# EAGLE design RCShield-arm-v0 (EAGLE 6.3)
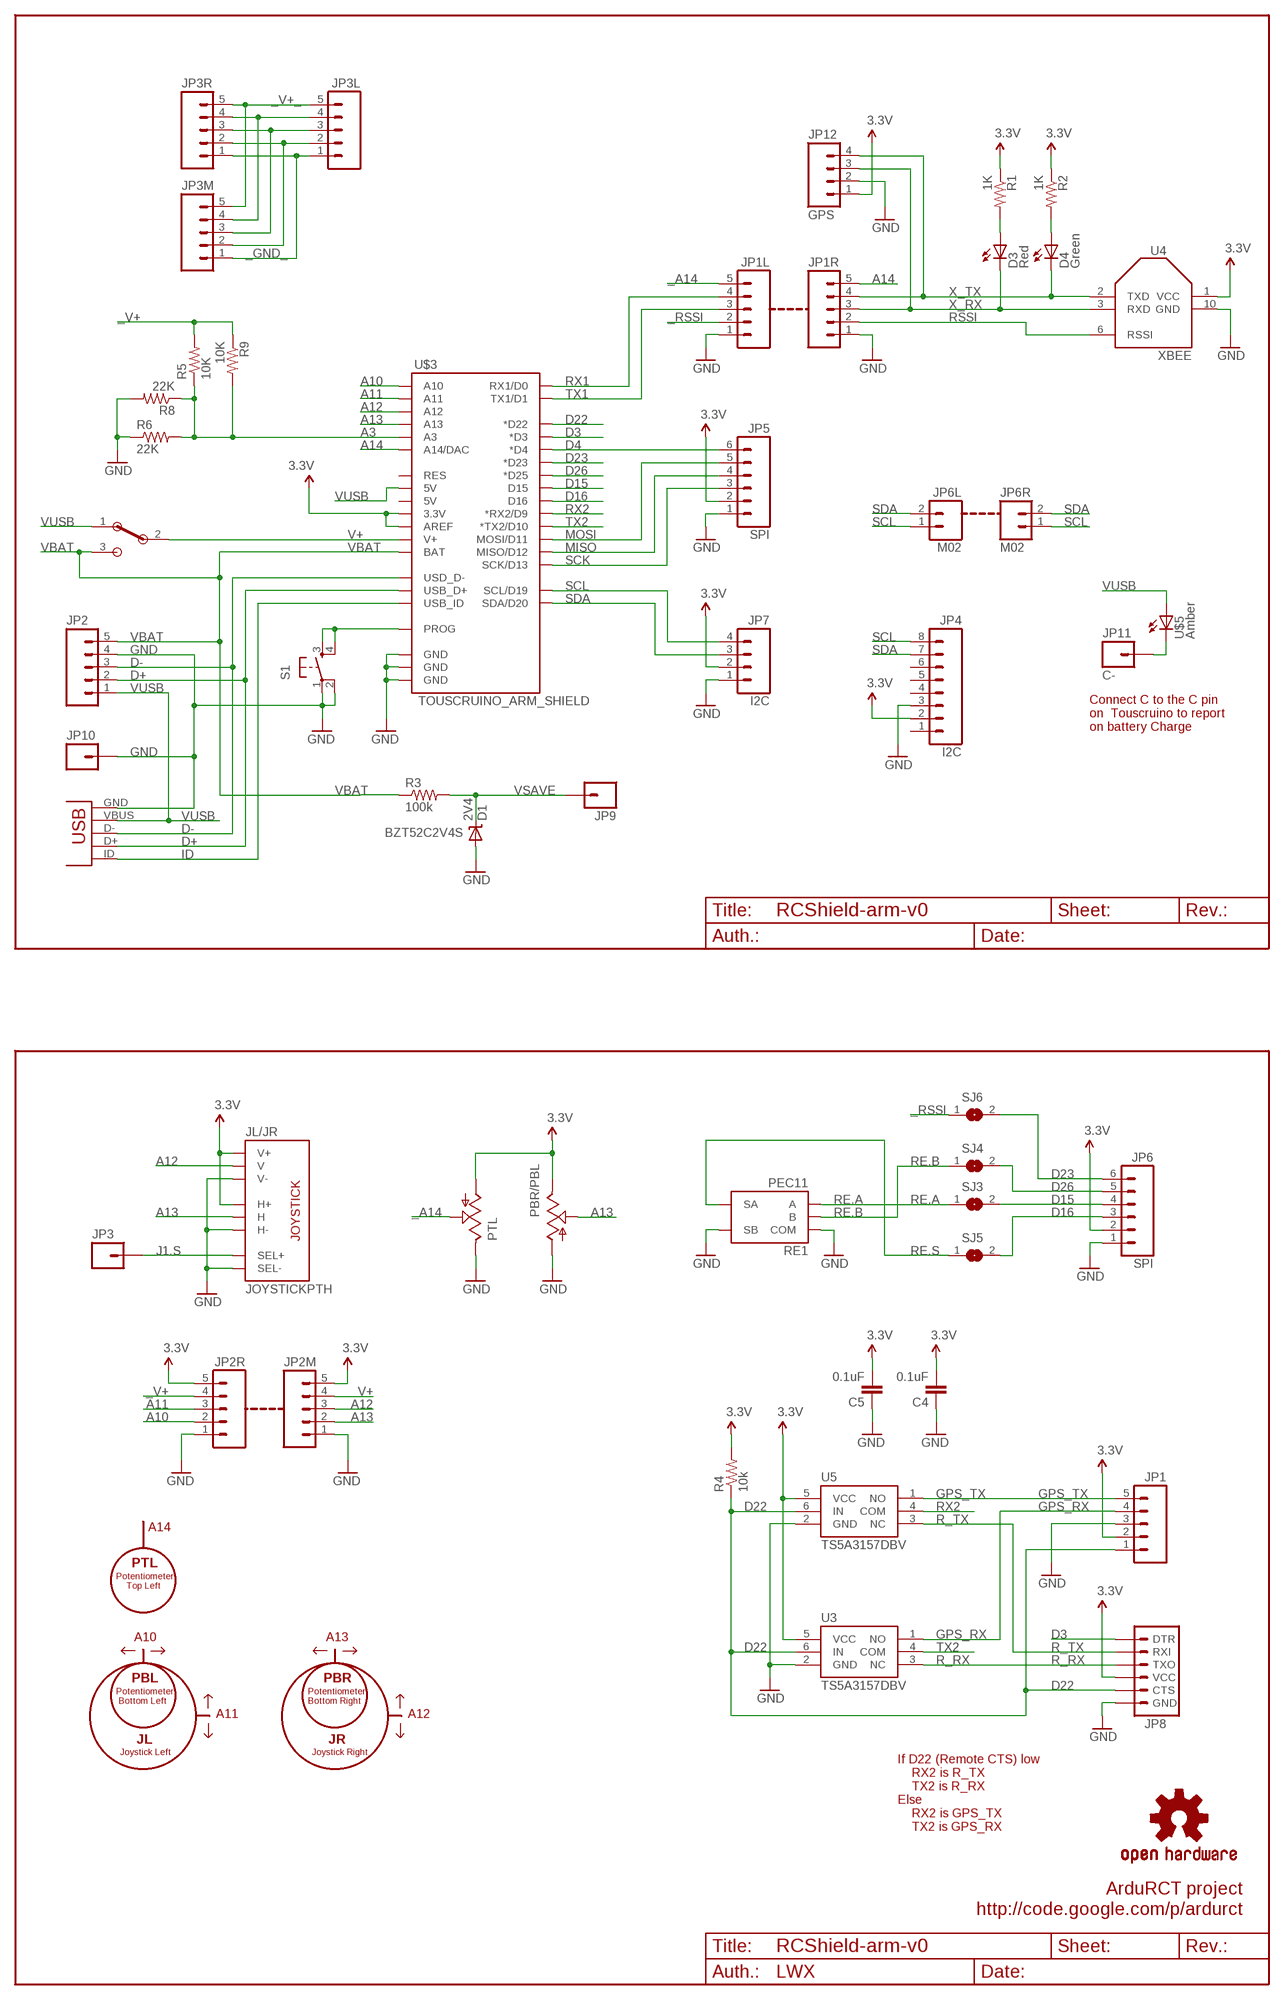
[diagram p0: schematic, sheet 1]

## Parts
C4  0.1uF  CAP0805  [0805]
C5  0.1uF  CAP0805  [0805]
D1  2V4  DIODE-ZENER-BZT52  [SOD-323]
D3  Red  LED  [LED]
D4  Green  LED  [LED]
JL/JR  JOYSTICKPTH  [JOYSTICK]
JP1  M05PTH  [1X05]
JP1L  M05  [2+3]
JP1R  M05  [2+3]
JP2  M05PTH  [1X05]
JP2M  M05  [2+3]
JP2R  M05  [2+3]
JP3  M01PTH  [1X01]
JP3L  M05  [2+3]
JP3M  M05  [2+3]
JP3R  M05  [2+3]
JP4  I2C  M08  [1X08]
JP5  SPI  M06SIP  [1X06]
JP6  SPI  M06SIP  [1X06]
JP6L  M02  [1X02]
JP6R  M02  [1X02]
JP7  I2C  M04  [1X04]
JP8  ARDUINO_SERIAL_PROGRAM  [1X06_F]
JP9  M01PTH  [1X01]
JP10  M01PTH  [1X01]
JP11  C-  M01PTH  [1X01]
JP12  GPS  M04  [1X04]
PBR/PBL  POT  [ALPS_POT]
PTL  POT  [ALPS_POT]
R1  1K  RESISTOR0805-RES  [0805]
R2  1K  RESISTOR0805-RES  [0805]
R3  100k  RESISTOR0805-RES  [0805]
R4  10k  RESISTOR0805-RES  [0805]
R5  10K  RESISTOR0805-RES  [0805]
R6  22K  RESISTOR0805-RES  [0805]
R8  22K  R-US_0207/7  [0207/7]
R9  10K  R-US_0207/7  [0207/7]
RE1  PEC11  [PEC11]
S1  TAC_SWITCHPTH  [TACTILE-PTH]
S4  EG1224  [EG1224]
SJ3  SJ  [SJ]
SJ4  SJ  [SJ]
SJ5  SJ  [SJ]
SJ6  SJ  [SJ]
U3  TS5A3157DBV  [SOT23-6]
U4  XBEE  XBEE-RSSI  [XBEE-SMD]
U5  TS5A3157DBV  [SOT23-6]
U$1  OSHW-LOGOM  [OSHW-LOGO-M]
U$3  TOUSCRUINO_ARM_SHIELD  [TOUSCRUINO_ARM_SHIELD_SPLIT]
U$5  Amber  LED  [LED]
X1  USB  [USB-MICROB]

## Nets
3.3V: C4.2 C5.2 JL/JR.H1(H+) JL/JR.V1(V+) JP1.2 JP2M.5 JP2R.5 JP4.2 JP5.2 JP6.2 JP7.2 JP8.4(VCC) JP12.1 PBR/PBL.P$1(E) PTL.P$3(A) R1.1 R2.1 R4.2 U3.5(VCC) U4.1(VCC) U5.5(VCC) U$3.3.3V U$3.AREF
_A14: JP1L.5 PTL.P$2(S)
_GND_ [vcc]: JP3L.1 JP3M.1 JP3R.1
_RSSI: JP1L.2 SJ6.1
_V+: JP2R.4 R5.2 R9.1
_V+_: JP3L.5 JP3M.5 JP3R.5
A3: R5.1 R6.2 R8.1 R9.2 U$3.A3
A10: JP2R.2 U$3.A10
A11: JP2R.3 U$3.A11
A12: JL/JR.V2(V) JP2M.3 U$3.A12
A13: JL/JR.H2(H) JP2M.2 PBR/PBL.P$2(S) U$3.A13
A14: JP1R.5 U$3.A14(A14/DAC)
C-: JP11.1 U$5.C1(C)
D3: JP8.1(DTR) U$3.D3(*D3)
D4: JP5.6 U$3.D4(*D4)
D15: JP6.4 SJ3.2 U$3.D15
D16: JP6.3 SJ5.2 U$3.D16
D22: JP1.1 JP8.5(CTS) R4.1 U3.6(IN) U5.6(IN) U$3.D22(*D22)
D23: JP6.6 SJ6.2 U$3.D23(*D23)
D26: JP6.5 SJ4.2 U$3.D25(*D25)
D+: JP2.2 U$3.USB_D+ X1.D+
D-: JP2.3 U$3.USB_D-(USD_D-) X1.D-
GND [vcc]: C4.1 C5.1 D1.2(A) JL/JR.B2A(SEL-) JL/JR.H3(H-) JL/JR.V3(V-) JP1.3 JP1L.1 JP1R.1 JP2.4 JP2M.1 JP2R.1 JP4.3 JP5.1 JP6.1 JP7.1 JP8.6(GND) JP10.1 JP12.2 PBR/PBL.P$3(A) PTL.P$1(E) R6.1 R8.2 RE1.C(COM) RE1.S2(SB) S1.1 S1.2 U3.2(GND) U4.10(GND) U5.2(GND) U$3.GND@0(GND) U$3.GND@1(GND) U$3.GND@2(GND) X1.GND
GPS_RX: JP1.4 U3.1(NO)
GPS_TX: JP1.5 U5.1(NO)
ID: U$3.USB_ID X1.ID
J1.S: JL/JR.B1A(SEL+) JP3.1
MISO: JP5.4 U$3.D12(MISO/D12)
MOSI: JP5.5 U$3.D11(MOSI/D11)
N$1: S1.3 S1.4 U$3.PROG
N$4: JP3L.4 JP3M.4 JP3R.4
N$5: JP3L.3 JP3M.3 JP3R.3
N$6: JP3L.2 JP3M.2 JP3R.2
N$14: D3.A1(A) R1.2
N$25: D4.A1(A) R2.2
R_RX: JP8.3(TXO) U3.3(NC)
R_TX: JP8.2(RXI) U5.3(NC)
RE.A: RE1.A SJ3.1
RE.B: RE1.B SJ4.1
RE.S: RE1.S1(SA) SJ5.1
RSSI: JP1R.2 U4.6(RSSI)
RX1: JP1L.4 U$3.RX1/D0
RX2: U5.4(COM) U$3.D9(*RX2/D9)
SCK: JP5.3 U$3.D13(SCK/D13)
SCL: JP4.8 JP6L.1 JP6R.1 JP7.4 U$3.SCL(SCL/D19)
SDA: JP4.7 JP6L.2 JP6R.2 JP7.3 U$3.SDA(SDA/D20)
TX1: JP1L.3 U$3.TX1/D1
TX2: U3.4(COM) U$3.D10(*TX2/D10)
V+: JP2M.4 S4.2 U$3.V+
VBAT: JP2.5 R3.1 S4.3 U$3.BAT
VSAVE: D1.1(C) JP9.1 R3.2
VUSB: JP2.1 S4.1 U$3.5V@1(5V) U$5.A1(A) X1.VBUS
X_RX: D3.C1(C) JP1R.3 JP12.3 U4.3(RXD)
X_TX: D4.C1(C) JP1R.4 JP12.4 U4.2(TXD)
Unconnected: JP4.1 JP4.4 JP4.5 JP4.6 U$3.5V@0(5V) U$3.RES

## Notes on the sheet
- Connect C to the C pin 
  on  Touscruino to report
  on battery Charge
- BZT52C2V4S
- A14
- PTL
- Potentiometer
      Top Left
- A10 | A13
- PBL | PBR
- Potentiometer
   Bottom Left
- Potentiometer
  Bottom Right
- A11 | A12
- JL | JR
- Joystick Left | Joystick Right
- If D22 (Remote CTS) low
      RX2 is R_TX
      TX2 is R_RX
  Else
      RX2 is GPS_TX
      TX2 is GPS_RX
- ArduRCT project
- http://code.google.com/p/ardurct
- LWX

## Library data of the parts
C4 C5 = SparkFun:CAP: Capacitor Standard 0603 ceramic capacitor, and 0.1" leaded capacitor.
D1 = SparkFun:DIODE-ZENER: Zener Diode Production Part - 8199 3.4V Zener Voltage
D3 D4 U$5 = wibauxl:LED
JL/JR = SparkFun:JOYSTICK: Thumb Joystick Joystick commonly found in PS2 controllers. Two pots and a select switch. Footprint proven. Spark Fun Electronics SKU : COM-09032
JP1 JP2 = SparkFun:M05: Header 5 Standard 5-pin 0.1" header. Use with straight break away headers (SKU : PRT-00116), right angle break away headers (PRT-00553), swiss pins (PRT-00743), machine pins (PRT-00117), and female headers (PRT-00115). Molex polarized connector foot print use with SKU : PRT-08230 with associated crimp pins and housings.
JP1L JP1R JP2M JP2R JP3L JP3M JP3R = wibauxl:M05
JP3 JP9-JP11 = SparkFun:M01: Header 1 Standard 1-pin 0.1" header. Use with straight break away headers (SKU : PRT-00116), right angle break away headers (PRT-00553), swiss pins (PRT-00743), machine pins (PRT-00117), and female headers (PRT-00115).
JP4 = wibauxl:M08
JP5 JP6 = SparkFun:M06: Header 6 Standard 6-pin 0.1" header. Use with straight break away headers (SKU : PRT-00116), right angle break away headers (PRT-00553), swiss pins (PRT-00743), machine pins (PRT-00117), and female headers (PRT-00115). Molex polarized connector foot print use with SKU : PRT-08094 with associated crimp pins and housings. NOTES ON THE VARIANTS LOCK and LOCK_LONGPADS... This footprint was designed to help hold the alignment of a through-hole component (i.e. 6-pin header) while soldering it into place. You may notice that each hole has been shifted either up or down by 0.005 of an inch from it's more standard position (which is a perfectly straight line). This slight alteration caused the pins (the squares in the middle) to touch the edges of the holes. Because they are alternating, it causes a "brace" to hold the component in place. 0.005 has proven to be the perfect amount of "off-center" position when using our standard breakaway headers. Although looks a little odd when you look at the bare footprint, once you have a header in there, the alteration is very hard to notice. Also, if you push a header all the way into place, it is covered up entirely on the bottom side. This idea of altering the position of holes to aid alignment will be further integrated into the Sparkfun Library for other footprints. It can help hold any component with 3 or more connection pins.
JP6L JP6R = wibauxl:M02
JP7 JP12 = wibauxl:M04
JP8 = wibauxl:ARDUINO_SERIAL_PROGRAM
PBR/PBL PTL = wibauxl:POT
R1-R6 = SparkFun:RESISTOR: Resistor Basic schematic elements and footprints for 0603, 1206, and PTH resistors.
R8 R9 = resistor:R-US_: RESISTOR, American symbol
RE1 = wibauxl:PEC11
S1 = SparkFun:TAC_SWITCH: Momentary Switch Button commonly used for reset or general input. Spark Fun Electronics SKU : COM-00097
S4 = wibauxl:EG1224
SJ3-SJ6 = jumper:SJ: SMD solder JUMPER
U3 U5 = wibauxl:TS5A3157DBV
U4 = wibauxl:XBEE-RSSI
U$1 = SparkFun:OSHW-LOGO: Open Source Hardware Logo This logo indicates the piece of hardware it is found on incorporates a OSHW license and/or adheres to the definition of open source hardware found here: http://freedomdefined.org/OSHW
U$3 = wibauxl:TOUSCRUINO_ARM_SHIELD
X1 = wibauxl:USB

## Net classes
0 default: width 0.203 mm
1 vcc: width 0.254 mm

## Board
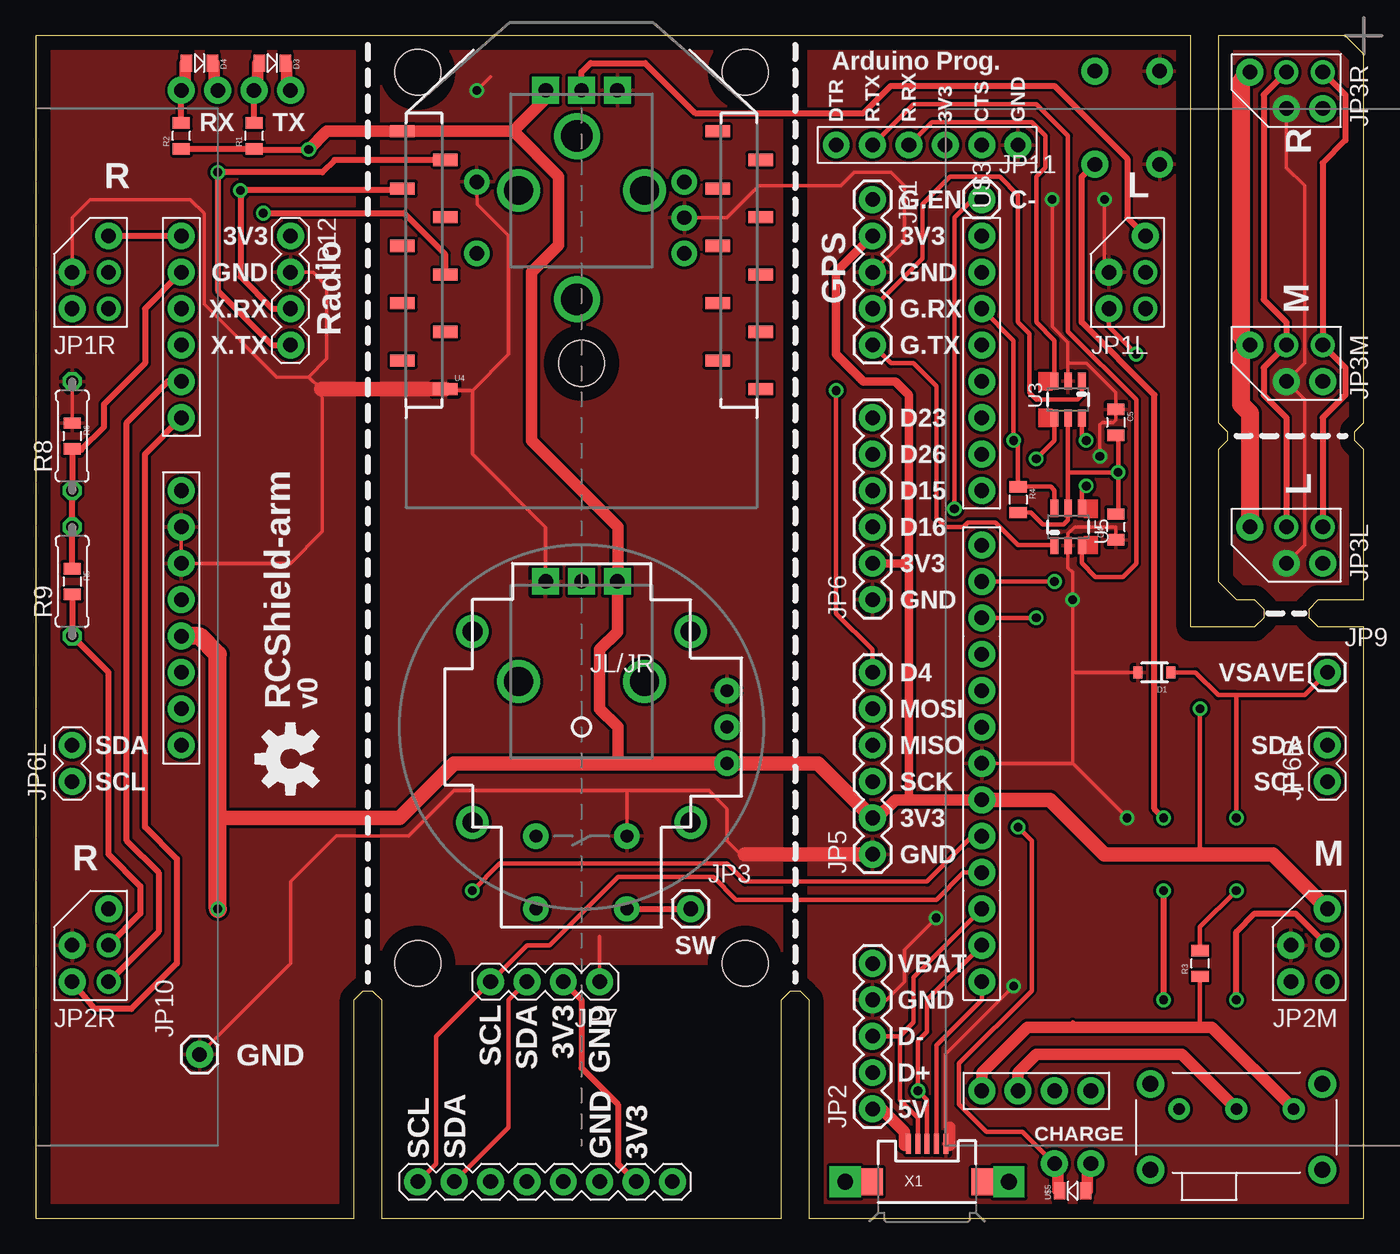
[diagram p1: board, top side]
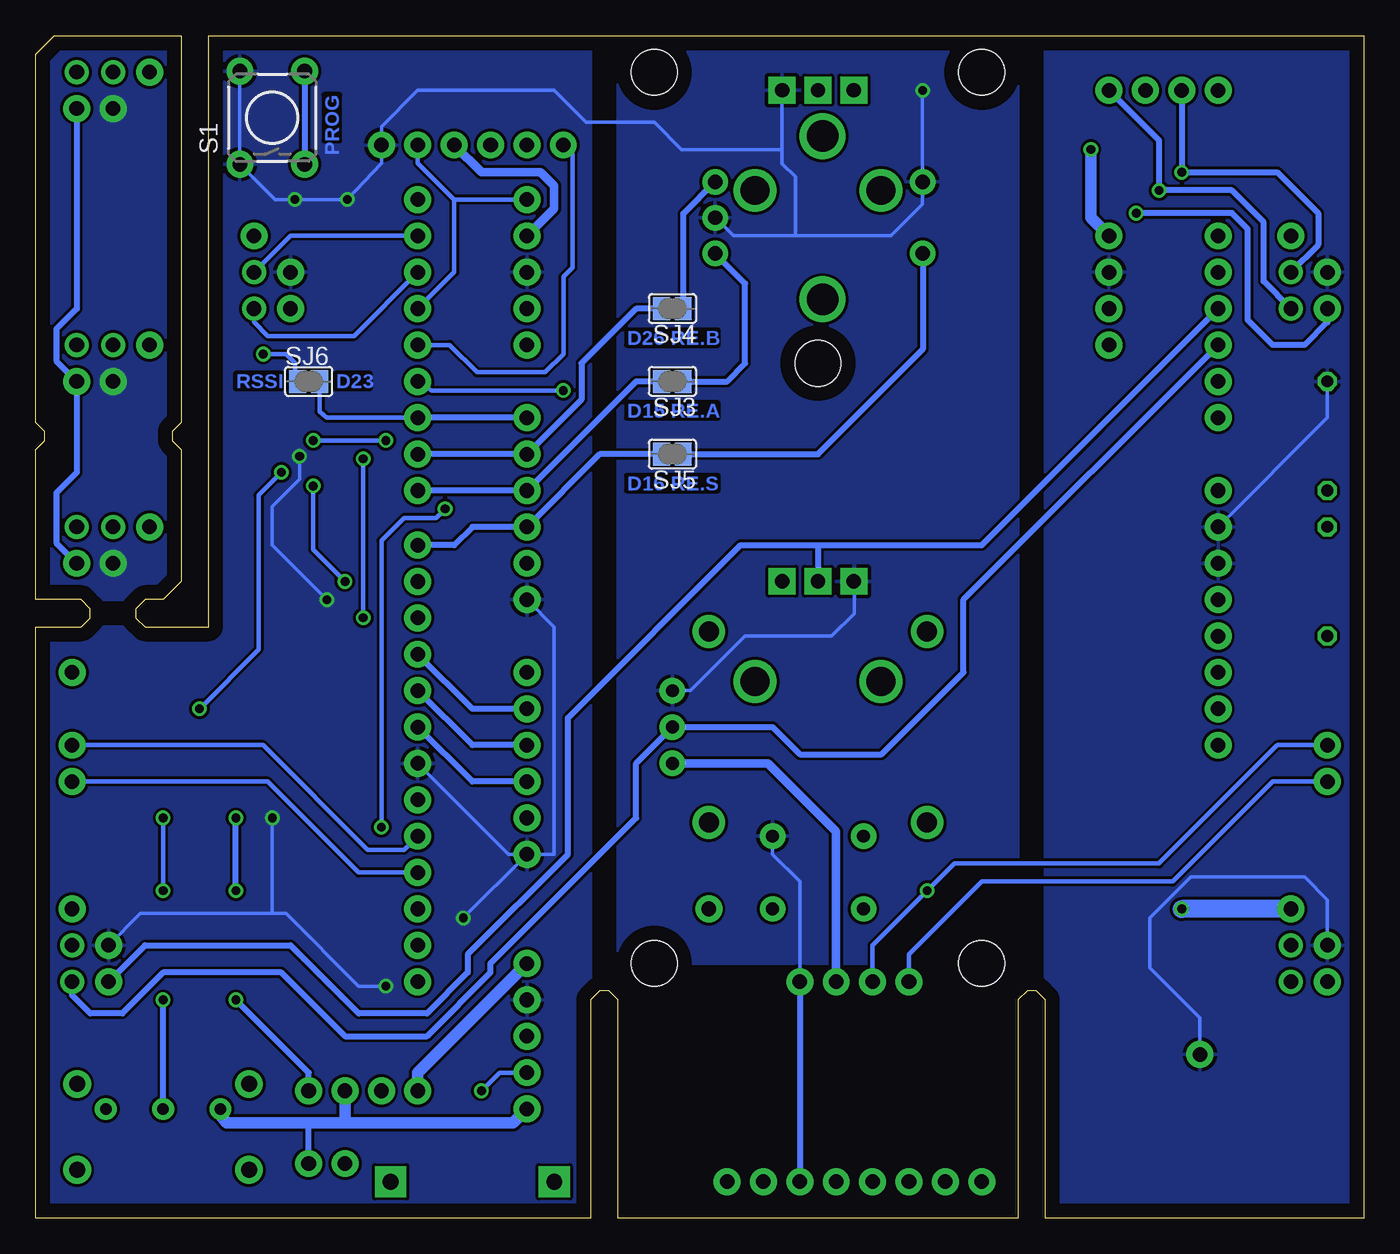
[diagram p2: board, bottom side, seen from below]

Size 92.71 x 82.55 mm. Coordinates in mm from the lower left corner, seen from the top.
Outline: 0,0 22.23,0 22.23,15.24 22.86,15.88 23.5,15.88 24.13,15.24 24.13,0 52.07,0 52.07,15.24 52.7,15.88 53.34,15.88 53.98,15.24 53.98,0 92.71,0 92.71,41.27 89.53,41.27 88.9,41.91 88.9,42.55 89.53,43.18 92.71,43.18 92.71,53.66 92.08,54.29 92.08,54.93 92.71,55.56 92.71,81.28 91.44,82.55 82.55,82.55 82.55,55.56 83.19,54.93 83.19,54.29 82.55,53.66 82.55,44.45 83.82,43.18 85.09,43.18 85.72,42.55 85.72,41.91 85.09,41.27 80.64,41.27 80.64,82.55 0,82.55 0,0
Copper layers (1*16): Top 0.035mm / dielectric 1.5mm / Bottom 0.035mm
Design rules "default *": minimum track width 10mil, minimum drill 24mil, track to track 8mil, track to pad 8mil, pad to pad 8mil, via to via 8mil, smd to smd 8mil, copper to edge 40mil, drill to drill 8mil, minimum pad ring 10mil, minimum via ring 8mil, stop-mask expansion 4mil, vias tented up to drill 0mil, thermal gap 10mil
Holes 3.2 mm at 49.53,17.78 26.67,17.78 26.67,80.01 49.53,80.01 38.1,59.69

### Footprints (pad centres in the part's own frame; a part is rotated, then mirrored left to right if it is on the bottom)
0805 = smd 0.8 x 1.2: 1 -0.9,0; 2 0.9,0
SOD-323 = smd 0.63 x 0.83: 1 -1.15,0; 2 1.15,0
LED = smd 0.8 x 1.2: A -0.9,0; C 0.9,0 | drill 1.016 pad 1.88: A1 -1.27,-1.905; C1 1.27,-1.905
JOYSTICK = drill 0.9 pad 1.778: B1A -3.175,12.7; B1B 3.175,12.7; B2A -3.175,7.62; B2B 3.175,7.62 | drill 0.889 pad 1.778: H1 -2.54,-10.16; H2 0,-10.16; H3 2.54,-10.16; V1 -10.16,2.54; V2 -10.16,0; V3 -10.16,-2.54 | drill 1.397 pad 2.286: MOUNT1 -7.62,6.668; MOUNT2 -7.62,-6.668; MOUNT3 7.62,-6.668; MOUNT4 7.62,6.668
1X05 = drill 1.016 pad 1.88: 1 0,0; 2 2.54,0; 3 5.08,0; 4 7.62,0; 5 10.16,0
2+3 = drill 1.016 pad 1.88: 1 -1.27,0; 2 1.27,0; 5 -3.81,2.54 | drill 1.016 pad 1.676: 3 1.27,2.54; 4 -1.27,2.54
1X01 = drill 1.016 pad 1.88: 1 0,0
1X08 = drill 1.016 pad 1.88: 1 0,0; 2 2.54,0; 3 5.08,0; 4 7.62,0; 5 10.16,0; 6 12.7,0; 7 15.24,0; 8 17.78,0
1X06 = drill 1.016 pad 1.88: 1 0,0; 2 2.54,0; 3 5.08,0; 4 7.62,0; 5 10.16,0; 6 12.7,0
1X02 = drill 1.016 pad 1.88: 1 0,0; 2 2.54,0
1X04 = drill 1.016 pad 1.88: 1 0,0; 2 2.54,0; 3 5.08,0; 4 7.62,0
1X06_F = drill 1.016 pad 1.88: 1 0,0; 2 2.54,0; 3 5.08,0; 4 7.62,0; 5 10.16,0; 6 12.7,0
ALPS_POT = drill 1 pad 1.88 square: P$1 7,-2.5; P$2 7,0; P$3 7,2.5 | drill 2: P$4 0,-4.4; P$5 0,4.4
0207/7 = drill 0.813 octagon: 1 -3.81,0; 2 3.81,0
PEC11 = drill 1 pad 1.778: A -2.5,-7.5; B 2.5,-7.5; C 0,-7.5; S1 -2.5,7; S2 2.5,7 | drill 2.2: SH1 -5.7,0; SH2 5.7,0
TACTILE-PTH = drill 1.016 pad 1.88: 1 -3.251,2.261; 2 3.251,2.261; 3 -3.251,-2.261; 4 3.251,-2.261
EG1224 = drill 0.8 pad 1.524: 1 -4,0; 2 0,0; 3 4,0 | drill 1.1 pad 1.93: P$4 6,1.75; P$5 -6,1.75; P$6 -6,-4.25; P$7 6,-4.25
SJ = smd 1.168 x 1.6: 1 -0.762,0; 2 0.762,0
SOT23-6 = smd 0.55 x 1.2: 1 -0.95,-1.3; 2 0,-1.3; 3 0.95,-1.3; 4 0.95,1.3; 5 0,1.3; 6 -0.95,1.3
XBEE-SMD = smd 1.7 x 0.85: 1 -12.5,20; 2 -9.5,18; 3 -12.5,16; 4 -9.5,14; 5 -12.5,12; 6 -9.5,10; 7 -12.5,8; 8 -9.5,6; 9 -12.5,4; 10 -9.5,2; 11 12.5,2; 12 9.5,4; 13 12.5,6; 14 9.5,8; 15 12.5,10; 16 9.5,12; 17 12.5,14; 18 9.5,16; 19 12.5,18; 20 9.5,20
TOUSCRUINO_ARM_SHIELD_SPLIT = drill 1.016 pad 1.88: 3.3V -27.94,-8.89; 5V@0 -27.94,-6.35; 5V@1 33.02,-40.64; A3 -27.94,16.51; A10 -27.94,6.35; A11 -27.94,8.89; A12 -27.94,11.43; A13 -27.94,13.97; A14 -27.94,19.05; AREF 27.94,-20.32; BAT 27.94,-40.64; D3 27.94,11.43; D4 27.94,8.89; D9 27.94,-5.08; D10 27.94,-7.62; D11 27.94,-10.16; D12 27.94,-12.7; D13 27.94,-15.24; D15 27.94,1.27; D16 27.94,-2.54; D22 27.94,13.97; D23 27.94,6.35; D25 27.94,3.81; GND@0 -27.94,-3.81; GND@1 -27.94,-1.27; GND@2 27.94,-17.78; IOREF -27.94,-13.97; NC -27.94,-16.51; PROG 35.56,-40.64; RES -27.94,-11.43; RX1/D0 27.94,19.05; SCL 27.94,-25.4; SDA 27.94,-22.86; TX1/D1 27.94,16.51; USB_D+ 27.94,-30.48; USB_D- 27.94,-27.94; USB_ID 27.94,-33.02; V+ 30.48,-40.64; VIN -27.94,1.27
USB-MICROB = smd 0.35 x 1.4: D+ 0,2.65; D- -0.65,2.65; GND 1.3,2.65; ID 0.65,2.65; VBUS -1.3,2.65 | smd 1.8 x 1.9: MT1 -4,0; MT2 4,0 | drill 1.1 pad 2.184 square: MT1A -5.715,0; MT2A 5.715,0

### Placement (x,y rotation side)
C4  75.41,48.26 90 top
C5  75.41,55.56 270 top
D1  78.11,38.1 180 top
D3  16.51,80.64 0 top
D4  11.43,80.64 0 top
JL/JR  38.1,34.29 180 top
JP1  58.42,71.12 270 top
JP1L  74.93,64.77 270 top
JP1R  2.54,64.77 270 top
JP2  58.42,7.62 90 top
JP2M  87.63,17.78 270 top
JP2R  2.54,17.78 270 top
JP3  45.72,21.59 0 top
JP3L  88.58,45.72 0 top
JP3M  88.58,58.42 0 top
JP3R  88.58,77.47 0 top
JP4  44.45,2.54 180 top
JP5  58.42,25.4 90 top
JP6  58.42,43.18 90 top
JP6L  2.54,30.48 90 top
JP6R  90.17,30.48 90 top
JP7  39.37,16.51 180 top
JP8  55.88,74.93 0 top
JP9  90.17,38.1 0 top
JP10  11.43,11.43 90 top
JP11  66.04,71.12 0 top
JP12  17.78,68.58 270 top
PBR/PBL  38.1,37.47 90 top
PTL  38.1,71.75 90 top
R1  15.24,75.56 90 top
R2  10.16,75.56 90 top
R3  81.28,17.78 90 top
R4  68.58,50.16 270 top
R5  2.54,44.45 270 top
R6  2.54,54.61 270 top
R8  2.54,54.61 90 top
R9  2.54,44.45 90 top
RE1  37.78,69.85 90 top
S1  76.2,76.83 90 bottom
S4  83.82,7.62 0 top
SJ3  48.26,58.42 180 bottom
SJ4  48.26,63.5 180 bottom
SJ5  48.26,53.34 180 bottom
SJ6  73.66,58.42 0 bottom
U3  72.07,57.15 180 top
U4  38.1,55.88 0 top
U5  72.07,48.26 0 top
U$1  17.78,32.07 90 top
U$3  38.1,49.53 0 top
U$5  72.39,1.91 180 top
X1  62.23,2.54 0 top

### Tracks (layer width: path | path; a pad name or v marks a point on that pad's centre or on a via)
3.3V  (via drill 0.61)
  Top 0.305: 72.07,52.07 U3.5 | C4.2 75.51,49.16 75.56,49.21 v75.56,52.07 | C5.2 75.56,54.93 v75.56,52.07 | R4.2 69.48,49.27 70.33,48.42 71.75,48.42 72.07,48.74 U5.5 72.07,52.07 | 72.07,52.07 v75.56,52.07 | v81.28,35.56 81.28,25.4
  Top 0.406: JP7.2 38.1,15.24 38.1,10.48 40.64,7.94 40.64,3.81 JP4.2 | R2.1 R1.1 15.29,74.61 v19.05,74.61 | PBR/PBL.P$1 40.62,44.47 JL/JR.H1
  Top 0.61: PTL.P$3 35.6,78.14 | 40.64,44.51 PBR/PBL.P$1 | 33.34,75.88 33.65,76.2 | 60.64,45.72 60.96,45.72 60.96,57.47 60.01,58.42 57.78,58.42 55.88,60.33 55.88,66.04 JP1.2 | 60.64,45.72 JP6.2 | 60.96,29.21 60.96,45.4 60.64,45.72 | 40.64,32.07 40.96,31.75
  Top 0.813: JP5.2 58.74,27.94 60.01,29.21 60.96,29.21 U$3.AREF | 35.6,78.14 33.65,76.2 | 40.64,44.51 40.64,48.26 34.61,54.29 34.61,66.04 36.51,67.94 36.51,72.71 33.34,75.88 U4.1 20.32,75.88 v19.05,74.61 | PBR/PBL.P$1 40.6,40.92 39.37,39.69 39.37,35.56 40.64,34.29 40.64,32.07
  Top 1.016: U$3.AREF 70.8,29.21 74.61,25.4 81.28,25.4 86.36,25.4 JP2M.5 | JP5.2 54.61,31.75 JL/JR.V1 40.96,31.75 29.21,31.75 25.4,27.94 12.7,27.94
  Top 1.27: v12.7,21.59 12.7,27.94 12.7,39.37 11.43,40.64 U$3.3.3V
  Bottom 0.305: v75.56,52.07 77.15,50.48 77.15,39.69 v81.28,35.56
  Bottom 0.61: JP7.2 36.83,26.99 41.59,31.75 JL/JR.V1 | JP8.4 61.59,73.03 57.47,73.03 56.52,72.07 56.52,70.48 JP1.2
  Bottom 0.813: JP12.1 19.05,69.85 v19.05,74.61
  Bottom 1.27: JP2R.5 v12.7,21.59
_A14
  Top 0.406: PTL.P$2 38.1,80.01 38.73,80.64 42.55,80.64 46.04,77.15 57.78,77.15 59.69,79.06 71.12,79.06 76.2,73.98 76.2,69.85 JP1L.5
_GND_
  Top 0.254: JP3R.1 87.31,73.34 88.58,72.07 88.58,59.69 JP3M.1 88.58,57.15 88.58,46.99 JP3L.1
  pour Bottom (no thermals): 82.55,82.55 93.98,82.55 93.98,43.18 82.55,43.18
  pour Top (no thermals): 82.55,82.55 96.52,82.55 96.52,43.18 82.55,43.18
_RSSI  (via drill 0.61)
  Top 0.305: JP1L.2 74.93,62.23 v76.83,60.33
  Bottom 0.254: 74.61,58.61 SJ6.1
  Bottom 0.305: v76.83,60.33 75.25,60.33 74.61,59.69 74.61,58.61
_V+
  Top 0.406: R5.2 R9.1 5.08,38.1 5.08,25.4 7.3,23.18 7.3,21.27 JP2R.4
_V+_
  Top 1.27: JP3R.5 84.14,79.38 84.14,61.59 JP3M.5 84.14,60.17 84.14,56.83 84.77,56.2 JP3L.5
A3
  Top 0.406: R5.1 R9.2 R8.1 2.54,53.66 | U$3.A3 7.62,63.5 7.62,59.69 4.76,56.83 4.76,55.24 3.17,53.66 2.54,53.66 | 2.54,53.66 R6.2
A10
  Top 0.406: U$3.A10 7.62,53.34 7.62,27.3 9.84,25.08 9.84,17.78 6.67,14.61 4.13,14.61 JP2R.2
A11
  Top 0.406: U$3.A11 9.21,58.42 6.35,55.56 6.35,26.35 8.57,24.13 8.57,20 JP2R.3
A12
  Bottom 0.406: U$3.A12 27.94,43.18 27.94,38.1 33.66,32.38 39.37,32.38 41.27,34.29 JL/JR.V2 50.8,31.75 50.8,27.94 60.96,17.78 60.96,17.14 65.41,12.7 71.12,12.7 75.56,17.14 83.82,17.14 86.68,14.29 88.9,14.29 90.17,15.56 JP2M.3
A13
  Bottom 0.406: 38.1,46.99 43.5,46.99 55.56,34.92 55.56,25.4 62.55,18.41 62.55,17.14 65.41,14.29 70.17,14.29 74.93,19.05 85.09,19.05 JP2M.2 | 38.1,46.99 PBR/PBL.P$2 JL/JR.H2 | 38.1,46.99 26.67,46.99 U$3.A13
A14
  Top 0.406: JP1R.5 U$3.A14
C-  (via drill 0.61)
  Top 0.305: JP11.1 65.41,71.12 64.14,69.85 v64.14,49.53 | v68.58,27.3 69.53,26.35 69.53,15.88 64.45,10.79 64.45,7.94 66.36,6.03 68.9,6.03 U$5.C1
  Bottom 0.305: v64.14,49.53 64.77,48.9 66.99,48.9 68.58,47.31 v68.58,27.3
D3
  Bottom 0.305: U$3.D3 63.82,60.96 61.91,59.05 57.15,59.05 55.88,60.33 55.88,65.72 55.24,66.36 55.24,74.3 JP8.1
D4  (via drill 0.61)
  Top 0.305: v55.88,57.78 55.88,42.23 58.42,39.69 JP5.6
  Bottom 0.305: U$3.D4 65.09,57.78 v55.88,57.78
D15
  Bottom 0.406: SJ3.2 50.8,58.42 JP6.4 U$3.D15
D16
  Bottom 0.406: SJ5.2 53.34,53.34 JP6.3 62.23,48.26 63.5,46.99 U$3.D16
D22  (via drill 0.61)
  Top 0.305: v73.34,54.29 73.31,54.29 73.03,54.61 73.02,54.61 U3.6 | U$3.D22 68.26,61.28 v68.26,54.29 68.58,53.98 R4.1 70.86,51.06 71.12,50.8 U5.6 71.09,49.53
  Bottom 0.305: v68.26,54.29 v73.34,54.29 | JP8.5 66.04,73.66 63.5,71.12 | 63.5,71.12 63.5,66.04 U$3.D22 | JP1.1 63.5,71.12
D23
  Bottom 0.305: SJ6.2 72.9,56.33 72.39,55.88 U$3.D23
  Bottom 0.406: JP6.6 U$3.D23
D26
  Bottom 0.406: SJ4.2 50.8,63.5 54.61,59.69 54.61,57.15 JP6.5 U$3.D25
D+  (via drill 0.61)
  Top 0.305: X1.D+ 62.23,8.26 v61.59,8.89 61.59,12.38 62.23,13.02 62.23,15.24 U$3.USB_D+
  Bottom 0.305: JP2.2 60.33,10.16 v61.59,8.89
D-
  Top 0.305: X1.D- 61.58,7 60.33,8.26 60.33,12.7 | 60.33,12.7 61.26,13.65 61.26,16.81 U$3.USB_D- | JP2.3 60.33,12.7
GND  (via drill 0.61)
  Top 0.254: 41.27,29.84 29.21,29.84 26.04,26.67 20.95,26.67 17.78,23.5 17.78,17.78 JP10.1 | R8.2 R6.1 | JP1R.1 2.54,69.85 3.81,71.12 10.79,71.12 11.75,70.17 11.75,63.82 16.83,58.74 19.05,58.74 | U$3.GND@1 U$3.GND@0 17.78,45.72 20,47.94 20,57.15 19.91,57.88 20.64,57.78 20.48,57.94 19.84,57.94 19.05,58.74 | 30.48,57.78 33.02,60.33 33.02,68.58 30.8,70.8 30.8,72.05 RE1.S2 | 30.48,57.78 28.7,57.78 U4.10 | RE1.C 48.26,69.85 50.48,72.07 56.2,72.07 57.15,73.03 59.69,73.03 60.64,72.07 60.64,68.26 JP1.3 | 72.07,59.69 73.34,59.69 75.41,57.63 C5.1 75.3,56.46 | 72.39,38.1 v72.39,43.18 72.39,45.09 72.07,45.4 U5.2 72.07,47.78 72.55,48.26 75.41,48.26 75.41,47.47 75.56,47.31 75.51,47.31 C4.1 | 72.39,38.1 72.39,31.75 | U3.2 72.07,59.69 | JP1L.1 74.61,66.36 v74.61,71.12 | v74.3,53.18 74.3,55.4 74.45,55.56 75.25,55.56 75.41,55.72 75.41,56.36 75.3,56.46 | 72.39,31.75 U$3.GND@2 | 41.27,29.84 46.99,29.84 48.26,28.57 48.26,26.35 49.21,25.4 49.53,25.4 | 41.27,29.84 JL/JR.B2A | 72.07,59.69 72.07,61.12 70.96,62.23 v70.96,71.12 | 30.48,57.78 30.48,53.34 35.6,48.22 PBR/PBL.P$3 | v30.8,78.74 31.75,79.69 | 72.39,31.75 v76.2,27.94 | 63.82,6.35 63.5,6.35 63.5,11.43 v68.26,16.19 | 39.37,19.68 JP7.1 | 75.3,56.46 75.25,56.52 75.56,56.52 75.25,56.2 | 19.05,58.74 20.32,60.01 20.32,65.09 19.37,66.04 JP12.2 | 59.37,15.24 60.64,16.51 60.64,18.73 v62.87,20.95 | D1.2 72.39,38.1
  Top 0.305: U5.2 72.07,46.99
  Top 0.406: X1.GND 63.71,5.19 63.82,5.08
  Top 0.813: 63.82,5.08 63.82,6.35
  Top 1.016: U4.10 19.91,57.88 | JP5.1 49.53,25.4
  Bottom 0.254: JP2R.1 2.54,22.23 4.13,23.81 12.06,23.81 14.92,20.95 14.92,17.46 11.43,13.97 JP10.1 | JL/JR.B2A 41.27,25.4 39.37,23.5 JP7.1 | R8.2 2.54,55.88 U$3.GND@1 | PTL.P$1 40.6,74.61 | 40.6,74.61 40.6,73.62 39.69,72.71 39.69,68.58 | 39.69,68.58 44.01,68.58 RE1.C | 39.69,68.58 33.02,68.58 30.8,70.8 30.8,72.33 | JP5.1 59.69,25.4 U$3.GND@2 | S1.2 S1.1 76,71.12 v74.61,71.12 v70.96,71.12 68.58,73.66 JP8.6 68.58,76.2 66.04,78.74 56.52,78.74 54.29,76.52 49.53,76.52 47.62,74.61 40.6,74.61 | v74.3,53.18 74.3,51.59 76.2,49.69 76.2,46.99 v72.39,43.18 | JP6.1 56.52,41.27 56.52,25.4 JP5.1 | 30.8,72.33 v30.8,78.74 | v76.2,27.94 76.2,21.27 | 76.2,21.27 85.41,21.27 JP2M.1 | 76.2,21.27 75.25,21.27 70.17,16.19 v68.26,16.19 | v62.87,20.95 JP5.1 | JL/JR.V3 46.99,36.83 43.18,40.64 37.15,40.64 35.56,42.23 JL/JR.H3 35.59,44.45 PBR/PBL.P$3 | 30.8,72.33 RE1.S2
  Bottom 0.406: JP7.1 JP4.3
  pour Top: 0,83.82 22.23,83.82 22.23,-2.54 0,-2.54
  pour Top: 24.13,83.82 52.07,83.82 52.07,17.78 24.13,17.78
  pour Bottom: 0,86.36 22.23,86.36 22.23,-1.27 0,-1.27
  pour Bottom: 24.13,86.36 52.07,86.36 52.07,17.78 24.13,17.78
  pour Top: 53.98,83.82 80.64,83.82 80.64,41.27 92.71,41.27 92.71,0 53.98,0
  pour Bottom: 53.98,86.36 80.64,86.36 80.64,41.27 92.71,41.27 92.71,0 53.98,0
GPS_RX
  Top 0.305: U3.1 73.03,57.47 72.71,57.15 69.85,57.15 69.37,57.63 69.37,61.75 68.58,62.55 68.58,71.44 67.31,72.71 63.82,72.71 61.91,70.8 61.91,66.99 JP1.4
GPS_TX
  Top 0.305: U5.1 71.12,46.99 68.58,46.99 66.99,48.58 65.09,48.58 64.77,48.26 63.5,48.26 62.87,48.9 62.87,58.1 61.28,59.69 59.69,59.69 JP1.5
ID
  Top 0.305: U$3.USB_ID 66.04,15.24 62.88,12.08 X1.ID
J1.S
  Top 0.406: JL/JR.B1A JP3.1
MISO
  Bottom 0.406: JP5.4 62.23,33.02 U$3.D12
MOSI
  Bottom 0.406: JP5.5 62.23,35.56 U$3.D11
N$1  (via drill 0.61)
  Top 0.406: v78.74,15.24 v78.74,22.86 | v78.74,27.94 78.11,28.57 78.11,57.47 73.03,62.55 73.03,72.71 73.94,73.62 S1.3
  Bottom 0.406: U$3.PROG 73.66,10.16 v78.74,15.24 | v78.74,22.86 v78.74,27.94 | S1.4 S1.3
N$4
  Top 0.406: JP3R.4 85.72,78.42 85.72,64.14 87.31,62.55 JP3M.4 85.72,59.37 85.72,57.47 87.31,55.88 JP3L.4
N$5
  Top 0.406: JP3R.3 91.44,78.42 91.44,75.25 89.85,73.66 JP3M.3 91.44,59.37 91.44,57.47 89.85,55.88 JP3L.3
N$6
  Bottom 0.406: JP3R.2 89.85,63.5 91.28,62.07 91.28,59.85 JP3M.2 89.85,52.07 91.28,50.64 91.28,47.15 JP3L.2
N$14
  Top 0.406: R1.2 D3.A1
N$25
  Top 0.406: R2.2 D4.A1
R_RX
  Top 0.305: U3.3 71.12,61.27 69.85,62.55 69.85,72.71 70.48,73.34 70.48,75.56 69.53,76.52 62.55,76.52 JP8.3
R_TX
  Top 0.305: U5.3 73.02,45.72 73.98,44.77 75.88,44.77 76.83,45.72 76.83,57.15 72.07,61.91 72.07,75.56 69.85,77.79 61.28,77.79 JP8.2
RE.A
  Bottom 0.406: SJ3.1 44.45,58.42 43.18,59.69 43.18,65.25 RE1.A
RE.B
  Bottom 0.406: SJ4.1 47.5,70.14 RE1.B
RE.S
  Bottom 0.406: SJ5.1 38.1,53.34 30.78,60.66 RE1.S1
RSSI  (via drill 0.61)
  Top 0.406: v15.88,70.17 25.72,70.17 28.57,67.31 28.57,65.91 U4.6
  Bottom 0.406: JP1R.2 2.54,62.55 4.13,60.96 6.35,60.96 8.1,62.71 8.1,69.06 9.21,70.17 v15.88,70.17
RX1
  Bottom 0.305: U$3.RX1/D0 74.93,68.58 JP1L.4
RX2  (via drill 0.61)
  Top 0.305: 73.06,49.56 U5.4 73.05,49.53 73.03,50.8 v73.34,51.12 | v71.12,44.45 U$3.D9
  Bottom 0.305: v73.34,51.12 73.34,46.67 v71.12,44.45
SCK
  Bottom 0.406: JP5.3 62.23,30.48 U$3.D13
SCL
  Top 0.305: JP4.8 27.94,3.81 27.94,12.7 JP7.4 34.29,19.05 35.88,19.05 40.64,23.81 47.31,23.81 48.9,22.23 62.87,22.23 64.77,24.13 U$3.SCL
  Bottom 0.305: JP6L.1 6.35,30.48 13.34,23.5 26.67,23.5 31.75,18.41 JP7.4 | U$3.SCL 70.17,24.13 76.52,30.48 JP6R.1
SDA  (via drill 0.61)
  Top 0.305: JP7.3 33.02,15.24 33.02,6.35 JP4.7 | U$3.SDA 65.41,26.67 62.23,23.5 49.53,23.5 48.26,24.77 32.38,24.77 v30.48,22.86
  Bottom 0.305: JP6L.2 6.03,33.02 14.29,24.77 28.57,24.77 v30.48,22.86 34.29,19.05 JP7.3 | U$3.SDA 66.99,25.72 69.53,25.72 76.83,33.02 JP6R.2
TX1
  Bottom 0.305: JP1L.3 77.47,62.55 76.52,61.59 70.48,61.59 U$3.TX1/D1
TX2  (via drill 0.61)
  Top 0.305: v69.85,41.91 U$3.D10 | U3.4 71.12,54.3 v69.85,53.02
  Bottom 0.305: v69.85,53.02 v69.85,41.91
V+  (via drill 0.61)
  Top 0.406: v83.82,15.24 83.82,20 85.09,21.27 87.95,21.27 JP2M.4
  Top 0.813: S4.2 80.01,11.43 69.85,11.43 68.58,10.16 U$3.V+
  Bottom 0.406: S4.2 v83.82,15.24
VBAT
  Top 0.305: 72.39,13.65 72.71,13.34 | R3.1 81.28,13.34
  Top 0.813: U$3.BAT 66.04,10.16 69.22,13.34 72.71,13.34 81.28,13.34 82.11,13.34 S4.3
  Bottom 0.813: U$3.BAT 66.04,10.16 JP2.5
VSAVE  (via drill 0.61)
  Top 0.305: R3.2 81.28,20.32 v83.82,22.86 | 83.5,27.94 v83.82,27.94 83.82,36.51 | 83.82,36.51 82.55,36.51 80.96,38.1 D1.1 | 83.82,36.51 88.58,36.51 JP9.1
  Bottom 0.305: v83.82,22.86 v83.82,27.94
VUSB
  Top 0.305: X1.VBUS 60.75,5.19 60.64,5.08
  Top 0.813: 60.64,5.08 60.64,6.03 59.05,7.62 JP2.1
  Bottom 0.406: U$5.A1 73.66,6.67
  Bottom 0.813: S4.1 79.82,7.17 79.38,6.67 73.66,6.67 71.12,6.67 | U$3.5V@1 71.12,6.67 | 71.12,6.67 59.37,6.67 JP2.1
X_RX  (via drill 0.61)
  Top 0.406: U4.3 25.37,71.88 25.24,71.75 v14.29,71.75 14.29,65.72 16.51,63.5 JP12.3
  Bottom 0.406: JP1R.3 6.99,65.41 6.99,69.53 9.21,71.75 v14.29,71.75 14.29,75.25 D3.C1
X_TX  (via drill 0.61)
  Top 0.406: U4.2 20.86,73.88 20,73.03 v12.7,73.03 12.7,64.77 16.51,60.96 JP12.4
  Bottom 0.406: JP1R.4 3.17,67.94 3.17,70.17 6.03,73.03 v12.7,73.03 D4.C1
(copper drawn outside any net)
  shapes: Top area x4

### Text on the board
Bottom: PROG | D26 RE.B | D23 | RSSI | D15 RE.A | D16 RE.S
tPlace: Arduino Prog. | DTR | R.TX | R.RX | 3V3 | CTS | GND | RX | TX | R | R | L | G.EN | C- | 3V3 | 3V3 | GND | GND | X.RX | GPS | G.RX | M | X.TX | Radio | G.TX | D23 | D26 | D15 | L | D16 | 3V3 | GND | VSAVE | D4 | RCShield-arm | v0 | MOSI | SDA | SDA | MISO | SCL | SCL | SCK | 3V3 | GND | M | R | SW | VBAT | SCL | SDA | 3V3 | GND | GND | D- | GND | D+ | 5V | CHARGE | SCL | SDA | GND | 3V3